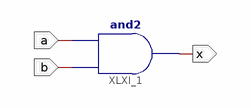
[diagram p0: schematic sheet 1]
// Xilinx ISE schematic and_test.sch (spartan3) as structural Verilog: 1 symbols, 3 ports
module and_test (
  input  a,
  input  b,
  output x
);

  and XLXI_1 (x, b, a);
endmodule
